# EAGLE design DiffController (EAGLE 9.6.2)
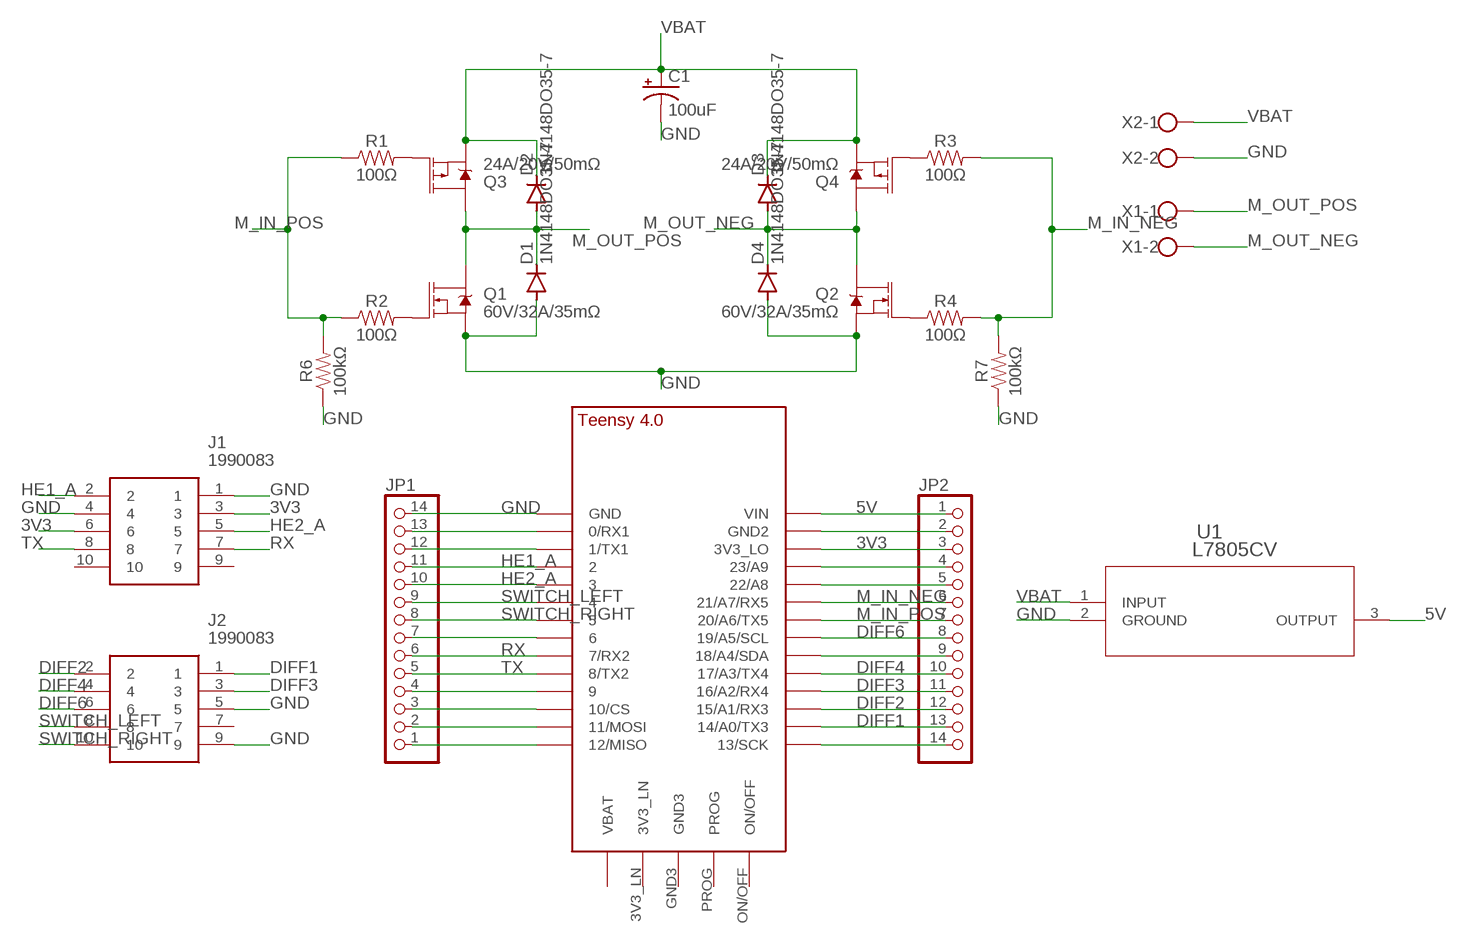
[diagram p0: schematic, sheet 1]

## Parts
C1  100uF  100UF-POLAR-RADIAL-2.5MM-25V-20%  [CPOL-RADIAL-2.5MM-6.5MM]
D1  1N4148DO35-7  [DO35-7]
D2  1N4148DO35-7  [DO35-7]
D3  1N4148DO35-7  [DO35-7]
D4  1N4148DO35-7  [DO35-7]
J1  1990083  [1990083]
J2  1990083  [1990083]
JP1  PINHD-1X14  [1X14]
JP2  PINHD-1X14  [1X14]
Q1  60V/32A/35mΩ  MOSFET-NCH-FQP30N06L  [TO220V]
Q2  60V/32A/35mΩ  MOSFET-NCH-FQP30N06L  [TO220V]
Q3  24A/20V/50mΩ  MOSFET_PCH-NDP6020P  [TO220V]
Q4  24A/20V/50mΩ  MOSFET_PCH-NDP6020P  [TO220V]
R1  100Ω  RESISTORAXIAL-0.3  [AXIAL-0.3]
R2  100Ω  RESISTORAXIAL-0.3  [AXIAL-0.3]
R3  100Ω  RESISTORAXIAL-0.3  [AXIAL-0.3]
R4  100Ω  RESISTORAXIAL-0.3  [AXIAL-0.3]
R6  100kΩ  RESISTORAXIAL-0.3  [AXIAL-0.3]
R7  100kΩ  RESISTORAXIAL-0.3  [AXIAL-0.3]
U1  L7805CV  [TO-220_STM]
U$2  TEENSY_4.0_EXPANDED_1  [TEENSY_4.0_EXPANDED_1]
X1  W237-102  [W237-102]
X2  W237-102  [W237-102]

## Nets
3V3: J1.3 J1.6 JP2.3 U$2.3V3_LO
5V: JP2.1 U1.3(OUTPUT) U$2.VIN
DIFF1: J2.1 JP2.13 U$2.14/A0(14/A0/TX3)
DIFF2: J2.2 JP2.12 U$2.15/A1(15/A1/RX3)
DIFF3: J2.3 JP2.11 U$2.16/A2(16/A2/RX4)
DIFF4: J2.4 JP2.10 U$2.17/A3(17/A3/TX4)
DIFF6: J2.6 JP2.8 U$2.19/A5/SCL
GND: C1.2(-) D1.A D4.A J1.1 J1.4 J2.5 J2.9 JP1.14 Q1.3(S) Q2.3(S) R6.P$1 R7.P$1 U1.2(GROUND) U$2.GND X2.2
HE1_A: J1.2 JP1.11 U$2.2
HE2_A: J1.5 JP1.10 U$2.3/CANTX
M_IN_NEG: JP2.6 R3.P$2 R4.P$2 R7.P$2 U$2.21/A7(21/A7/RX5)
M_IN_POS: JP2.7 R1.P$1 R2.P$1 R6.P$2 U$2.20/A6(20/A6/TX5)
M_OUT_NEG: D3.A D4.C Q2.2(D) Q4.2(D) X1.2
M_OUT_POS: D1.C D2.A Q1.2(D) Q3.2(D) X1.1
N$1: JP2.9 U$2.18/A4/SDA
N$2: JP2.4 U$2.23/A9
N$3: JP1.13 U$2.0/RX(0/RX1)
N$4: JP1.12 U$2.1/TX(1/TX1)
N$5: JP2.2 U$2.GND2
N$6: JP1.4 U$2.9/CS
N$7: JP1.3 U$2.10/CS
N$8: JP1.2 U$2.11/MOSI
N$9: JP1.1 U$2.12/MISO
N$10: JP2.14 U$2.13/SCK
N$11: JP1.7 U$2.6
N$12: JP2.5 U$2.22/A8
N$13: Q1.1(G) R2.P$2
N$14: Q2.1(G) R4.P$1
N$15: Q3.1(G) R1.P$2
N$16: Q4.1(G) R3.P$1
RX: J1.7 JP1.6 U$2.7(7/RX2)
SWITCH_LEFT: J2.8 JP1.9 U$2.4/CANRX
SWITCH_RIGHT: J2.10 JP1.8 U$2.5
TX: J1.8 JP1.5 U$2.8(8/TX2)
VBAT: C1.1(+) D2.C D3.C Q3.3(S) Q4.3(S) U1.1(INPUT) X2.1
Unconnected: J1.9 J1.10 J2.7 U$2.3V3_LN U$2.GND3 U$2.ON/OFF U$2.PROG U$2.VBAT\(VBAT)

## Library data of the parts
C1 = SparkFun-Capacitors:100UF-POLAR: 100µF polarized capacitors A capacitor is a passive two-terminal electrical component used to store electrical energy temporarily in an electric field.; PROD_ID: CAP-08439
D1-D4 = diode:1N4148: DIODE high speed (Philips)
J1 J2 = 1990083:1990083: Phoenix Contact PTSA 0.5/10-2.5-Z Non-Fused Terminal Block, 10 Way/Pole, Solder Terminals, 24 20 AWG Source: Datasheet <https://www.phoenixcontact.com/online/portal/in/?uri=pxc-oc-itemdetail:pid=1990083&library=inen&pcck=P-11-01-05&tab=1&selectedCategory=ALL>; ARROW_PART_NUMBER: 1990083; ARROW_PRICE-STOCK: https://www.arrow.com/en/products/1990083/phoenix-contact; DESCRIPTION: Phoenix Contact PTSA 0.5/10-2.5-Z Non-Fused Terminal Block, 10 Way/Pole, Solder Terminals, 24 20 AWG; HEIGHT: 13.1mm; MANUFACTURER_NAME: Phoenix Contact; MANUFACTURER_PART_NUMBER: 1990083; MOUSER_PART_NUMBER: 651-1990083; MOUSER_PRICE-STOCK: https://www.mouser.co.uk/ProductDetail/Phoenix-Contact/1990083?qs=eiqBpq341KUxP7V1ZFOCBQ%3D%3D
JP1 JP2 = Connectors:PINHD-1X14: PIN HEADER
Q1 Q2 = SparkFun-DiscreteSemi:MOSFET-NCH: N-channel MOSFETs Voltage controlled devices that allow control of high current outputs. SparkFun Products: SparkFun OpenScale <https://www.sparkfun.com/products/13261> SparkFun Digital Sandbox <https://www.sparkfun.com/products/12651> SparkFun Monster Moto Shield <https://www.sparkfun.com/products/10182> SparkFun MOSFET Power Controller <https://www.sparkfun.com/products/11214>; PROD_ID: TRANS-10060
Q3 Q4 = SparkFun-DiscreteSemi:MOSFET_PCH: P-channel MOSFETs Voltage controlled devices that allow control of high current outputs. SparkFun Products: SparkFun ESP32 Thing <https://www.sparkfun.com/products/13907> SparkFun ESP8266 Thing <https://www.sparkfun.com/products/13231>; PROD_ID: TRANS-13060
R1-R4 R6 R7 = SparkFun-Resistors:RESISTOR: Generic Resistor Package
U1 = L7805CV:L7805CV; BUILT_BY: EMA_UL_Team; MANUFACTURER_PART_NUMBER: L7805CV; SOURCELIBRARY: Updates_to_database_2020-11-10; VENDOR: STMicroelectronics
U$2 = Microcontroller:TEENSY_4.0_EXPANDED_1
X1 X2 = con-wago-500:W237-102: WAGO SCREW CLAMP; MPN: 237-102; OC_FARNELL: unknown; OC_NEWARK: 70K9898

## Board
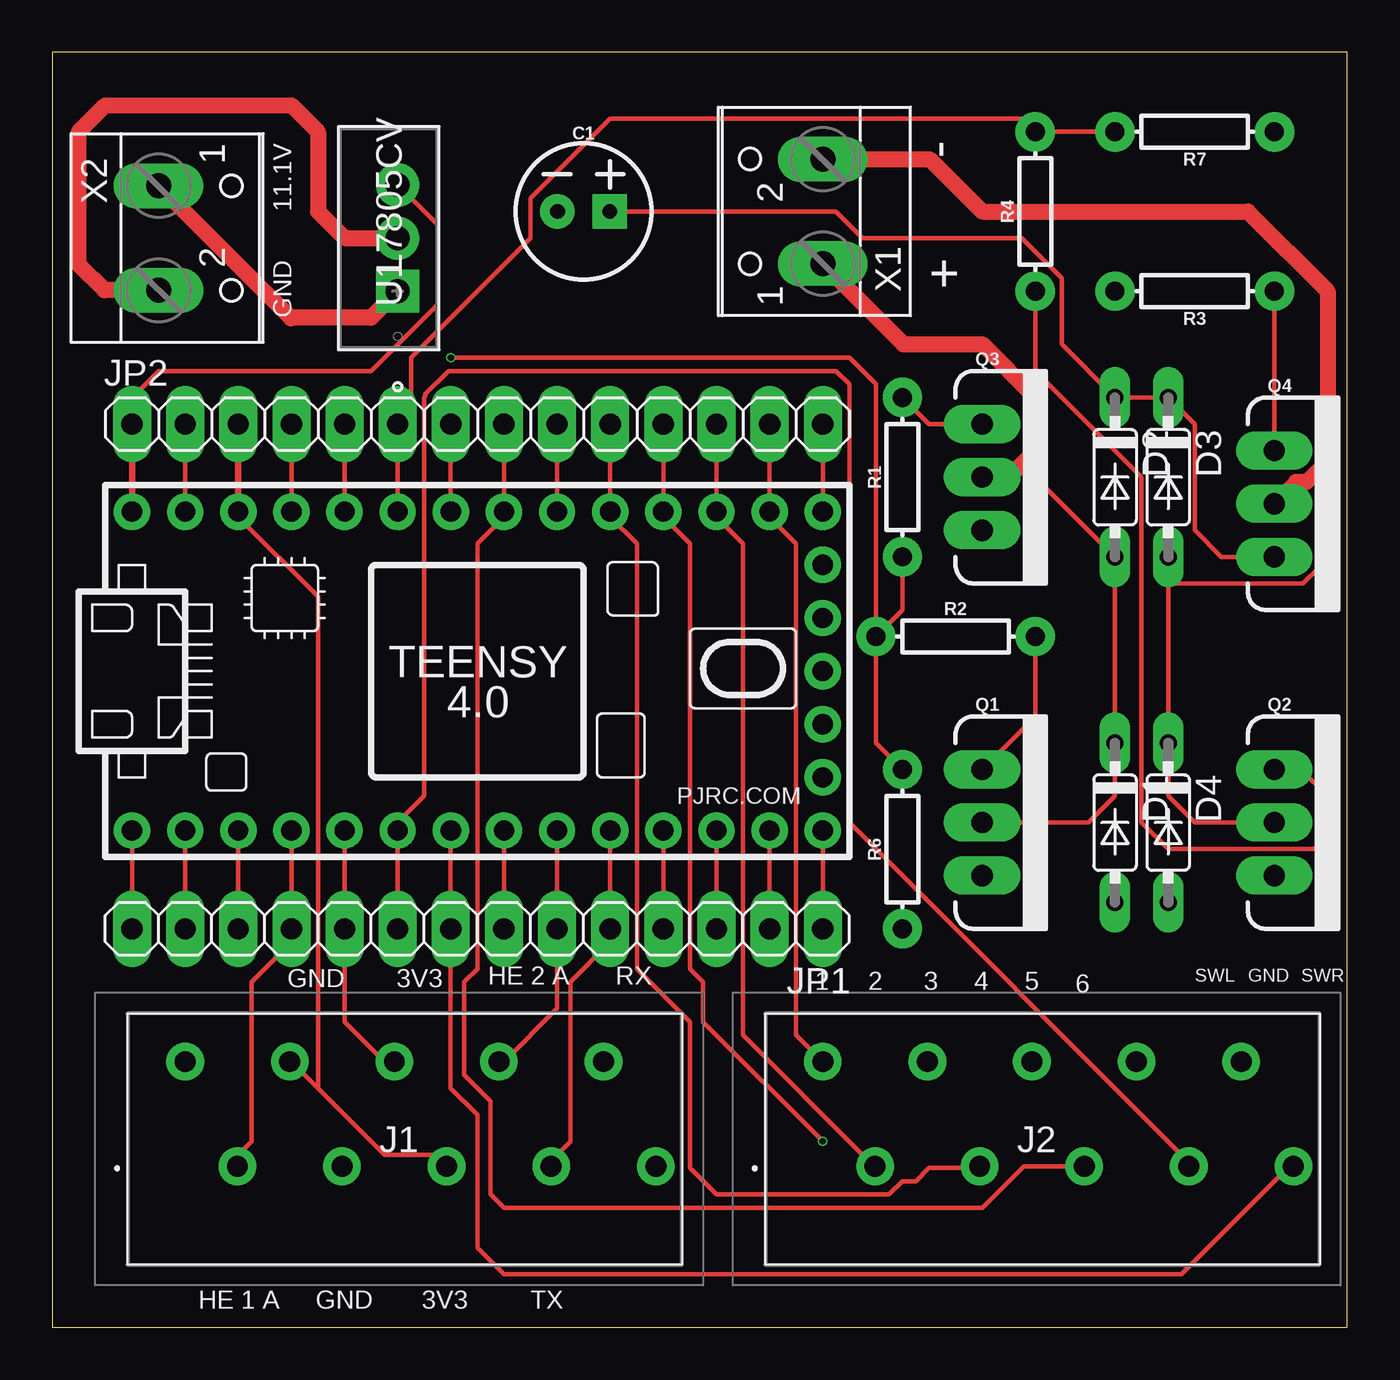
[diagram p1: board, top side]
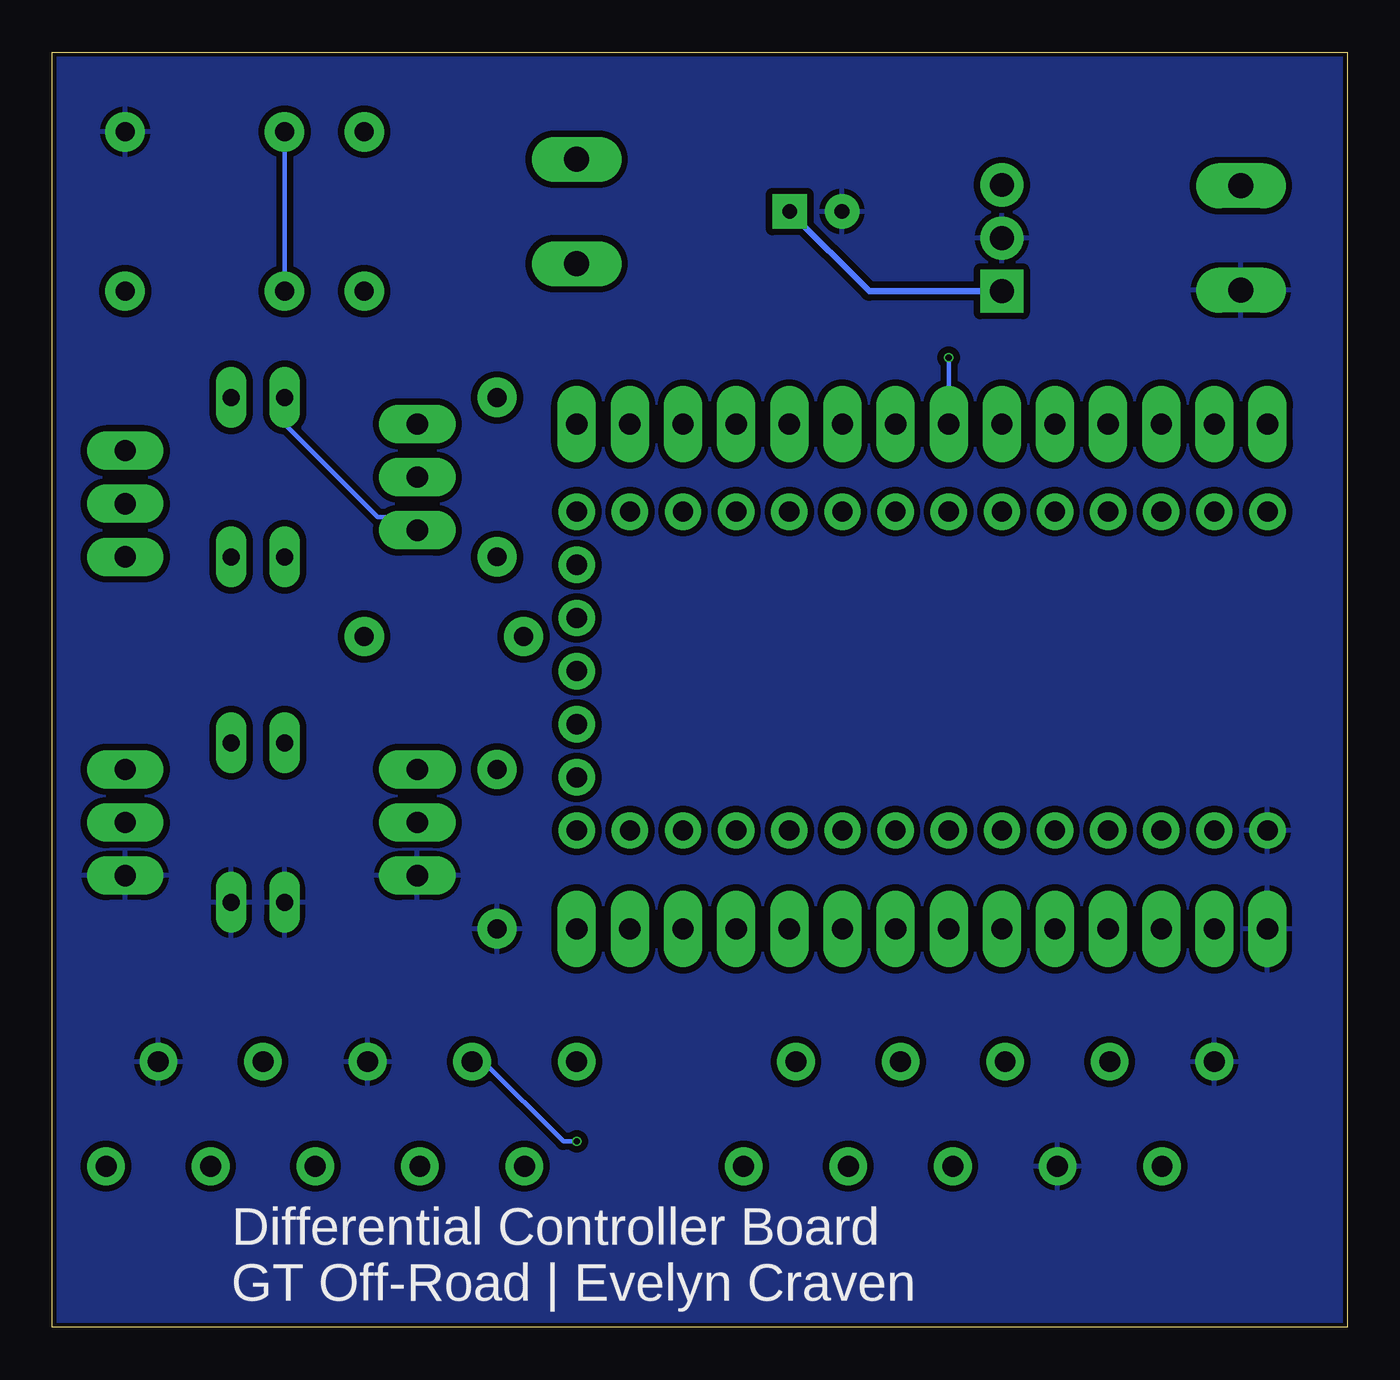
[diagram p2: board, bottom side, seen from below]

Size 61.9 x 60.95 mm. Coordinates in mm from the lower left corner, seen from the top.
Outline: 0,0 61.9,0 61.9,60.95 0,60.95 0,0
Copper layers (1*16): Top 0.035mm / dielectric 1.6mm / Bottom 0.035mm
Design rules "jlcpcb-2layers *": minimum track width 8mil, minimum drill 0.3mm, track to track 12mil, track to pad 8mil, pad to pad 8mil, via to via 8mil, smd to smd 5mil, copper to edge 0.2mm, drill to drill 6mil, minimum pad ring 10mil, minimum via ring 3mil, stop-mask expansion 4mil, vias tented up to drill 0mil, thermal gap 10mil

### Footprints (pad centres in the part's own frame; a part is rotated, then mirrored left to right if it is on the bottom)
CPOL-RADIAL-2.5MM-6.5MM = drill 0.7 pad 1.651 square: 1 1.25,0 | drill 0.7 pad 1.651: 2 -1.25,0
DO35-7 = drill 0.813 long: A 3.81,0; C -3.81,0
1990083 = drill 1 pad 1.5: 1 0,0; 2 2.5,-5; 3 5,0; 4 7.5,-5; 5 10,0; 6 12.5,-5; 7 15,0; 8 17.5,-5; 9 20,0; 10 22.5,-5
1X14 = drill 1.016 long: 1 -16.51,0; 2 -13.97,0; 3 -11.43,0; 4 -8.89,0; 5 -6.35,0; 6 -3.81,0; 7 -1.27,0; 8 1.27,0; 9 3.81,0; 10 6.35,0; 11 8.89,0; 12 11.43,0; 13 13.97,0; 14 16.51,0
TO220V = drill 1.016 long: 1 -2.54,0; 2 0,0; 3 2.54,0
AXIAL-0.3 = drill 0.9 pad 1.88: P$1 -3.81,0; P$2 3.81,0
TO-220_STM = drill 1.143 pad 1.651 square: 1 0,0 | drill 1.143 pad 1.651: 2 2.54,0; 3 5.08,0
TEENSY_4.0_EXPANDED_1 = drill 0.965: 0/RX -13.97,-7.62; 1/TX -11.43,-7.62; 2 -8.89,-7.62; 3/CANTX -6.35,-7.62; 3V3_LN 16.51,-2.54; 3V3_LO -11.43,7.62; 4/CANRX -3.81,-7.62; 5 -1.27,-7.62; 6 1.27,-7.62; 7 3.81,-7.62; 8 6.35,-7.62; 9/CS 8.89,-7.62; 10/CS 11.43,-7.62; 11/MOSI 13.97,-7.62; 12/MISO 16.51,-7.62; 13/SCK 16.51,7.62; 14/A0 13.97,7.62; 15/A1 11.43,7.62; 16/A2 8.89,7.62; 17/A3 6.35,7.62; 18/A4/SDA 3.81,7.62; 19/A5/SCL 1.27,7.62; 20/A6 -1.27,7.62; 21/A7 -3.81,7.62; 22/A8 -6.35,7.62; 23/A9 -8.89,7.62; GND -16.51,-7.62; GND2 -13.97,7.62; GND3 16.51,0; ON/OFF 16.51,5.08; PROG 16.51,2.54; VBAT\ 16.51,-5.08; VIN -16.51,7.62
W237-102 = drill 1.194 long: 1 -2.5,-1.27; 2 2.5,-1.27

### Placement (x,y rotation side)
C1  25.4,53.34 0 top
D1  50.8,24.13 270 top
D2  50.8,40.64 270 top
D3  53.34,40.64 270 top
D4  53.34,24.13 270 top
J1  6.35,12.7 0 top
J2  36.83,12.7 0 top
JP1  20.32,19.05 180 top
JP2  20.32,43.18 0 top
Q1  44.45,24.13 270 top
Q2  58.42,24.13 270 top
Q3  44.45,40.64 270 top
Q4  58.42,39.37 270 top
R1  40.64,40.64 90 top
R2  43.18,33.02 0 top
R3  54.61,49.53 180 top
R4  46.99,53.34 90 top
R6  40.64,22.86 90 top
R7  54.61,57.15 180 top
U1  16.51,49.53 90 top
U$2  20.32,31.37 0 top
X1  35.56,53.34 90 top
X2  6.35,52.07 270 top

### Tracks (layer width: path | path; a pad name or v marks a point on that pad's centre or on a via)
3V3
  Top 0.203: 12.7,11.43 15.88,8.26 18.41,8.26 J1.6 | 12.7,11.43 11.43,12.7 J1.3 | 12.7,11.43 12.7,34.92 8.89,38.73 U$2.3V3_LO
  Top 0.305: U$2.3V3_LO JP2.3
5V
  Top 0.203: U1.3 18.41,52.7 18.41,48.89 15.24,45.72 5.08,45.72 3.81,44.45 JP2.1
  Top 0.305: U$2.VIN JP2.1
DIFF1
  Top 0.203: JP2.13 U$2.14/A0 34.29,38.73 35.56,37.46 35.56,13.97 J2.1
DIFF2
  Top 0.203: JP2.12 U$2.15/A1 31.75,38.73 33.02,37.46 33.02,13.97 38.73,8.26 J2.2
DIFF3  (via drill 0.3)
  Top 0.203: JP2.11 U$2.16/A2 29.21,38.73 30.48,37.46 30.48,17.14 31.11,16.51 31.11,14.61 v36.83,8.89
  Bottom 0.203: v36.83,8.89 37.47,8.89 41.27,12.7 J2.3
DIFF4
  Top 0.203: JP2.10 U$2.17/A3 26.67,38.73 27.94,37.46 27.94,17.14 30.48,14.61 30.48,7.62 31.75,6.35 40.01,6.35 40.64,6.99 41.27,6.99 41.91,7.62 43.81,7.62 J2.4
DIFF6
  Top 0.203: JP2.8 U$2.19/A5/SCL 21.59,38.73 20.32,37.46 20.32,17.14 19.68,16.51 19.68,12.07 20.95,10.79 20.95,6.35 21.59,5.71 44.45,5.71 46.44,7.7 J2.6
GND
  Top 0.203: U$2.GND JP1.14
  Top 0.762: X2.2 2.5,49.57 1.27,50.8 1.27,57.15 2.54,58.42 11.43,58.42 12.7,57.15 12.7,53.34 13.97,52.07 U1.2
  pour Bottom: 0,60.96 62.23,60.96 62.23,0 0,0
HE1_A
  Top 0.203: U$2.2 JP1.11 11.43,18.41 9.53,16.51 9.53,8.89 8.89,8.26 J1.2
HE2_A
  Top 0.203: U$2.3/CANTX JP1.10 13.97,14.61 15.88,12.7 J1.5
M_IN_NEG
  Top 0.203: U$2.21/A7 JP2.6 17.14,43.81 17.14,46.35 22.86,52.07 22.86,53.97 26.67,57.78 46.99,57.78 R4.P$2 R7.P$2
  Bottom 0.203: R7.P$2 R3.P$2
M_IN_POS  (via drill 0.3)
  Top 0.203: JP2.7 U$2.20/A6 | R2.P$1 40.64,34.29 R1.P$1 | R6.P$2 39.37,27.94 R2.P$1 | v19.05,46.35 38.1,46.35 39.37,45.08 R2.P$1
  Bottom 0.203: v19.05,46.35 JP2.7
M_OUT_NEG
  Top 0.203: 53.34,35.56 D4.C 53.34,25.4 54.61,24.13 Q2.2 | 60.96,41.42 60.96,36.83 60.55,36.42 60.55,36.32 59.79,35.56 53.34,35.56 | 53.34,35.56 D3.A
  Top 0.762: X1.2 41.95,55.84 44.45,53.34 57.15,53.34 60.96,49.53 60.96,41.42 59.95,40.41 59.46,40.41 Q4.2
M_OUT_POS
  Top 0.203: Q1.2 49.53,24.13 50.8,25.4 D1.C D2.A 46.35,41.27
  Top 0.762: X1.1 40.68,46.99 44.45,46.99 46.99,44.45 46.99,41.91 46.35,41.27 45.72,40.64 Q3.2
N$1
  Top 0.203: JP2.9 U$2.18/A4/SDA
N$2
  Top 0.203: JP2.4 U$2.23/A9
N$3
  Top 0.203: JP1.13 U$2.0/RX
N$4
  Top 0.203: JP1.12 U$2.1/TX
N$5
  Top 0.203: JP2.2 U$2.GND2
N$6
  Top 0.203: JP1.4 U$2.9/CS
N$7
  Top 0.203: JP1.3 U$2.10/CS
N$8
  Top 0.203: JP1.2 U$2.11/MOSI
N$9
  Top 0.203: JP1.1 U$2.12/MISO
N$10
  Top 0.203: JP2.14 U$2.13/SCK
N$11
  Top 0.203: JP1.7 U$2.6
N$12
  Top 0.203: JP2.5 U$2.22/A8
N$13
  Top 0.203: Q1.1 46.99,29.21 R2.P$2
N$14
  Top 0.203: Q2.1 59.69,26.67 60.96,25.4 60.96,23.5 60.33,22.86 53.34,22.86 52.07,24.13 52.07,40.64 46.99,45.72 R4.P$1
N$15
  Top 0.203: Q3.1 41.91,43.18 R1.P$2
N$16
  Top 0.203: R3.P$1 Q4.1
RX
  Top 0.203: U$2.7 JP1.6 24.13,15.24 21.59,12.7 J1.7
SWITCH_LEFT
  Top 0.203: JP1.9 U$2.4/CANRX 16.51,24.13 17.78,25.4 17.78,44.45 17.83,44.5 17.83,44.6 18.95,45.72 37.47,45.72 38.1,45.08 38.1,24.13 53.98,8.26 J2.8
SWITCH_RIGHT
  Top 0.203: U$2.5 JP1.8 19.05,11.43 20.32,10.16 20.32,3.81 21.59,2.54 53.98,2.54 59.05,7.62 J2.10
TX
  Top 0.203: U$2.8 JP1.5 26.67,18.41 24.77,16.51 24.77,8.89 24.13,8.26 J1.8
VBAT
  Top 0.203: Q4.3 55.88,36.83 54.61,38.1 54.61,43.18 D3.C D2.C 48.26,46.99 48.26,50.16 46.35,52.07 38.73,52.07 37.47,53.34 C1.1
  Top 0.762: X2.1 11.42,48.23 11.47,48.26 15.24,48.26 U1.1
  Bottom 0.203: Q3.3 45.09,38.73 46.35,38.73 50.8,43.18 D2.C
  Bottom 0.305: U1.1 22.84,49.53 C1.1

### Text on the board
tPlace: - | 11.1V | + | GND | GND | 3V3 | HE 2 A | RX | SWL | GND | SWR | 1 | 2 | 3 | 4 | 5 | 6 | HE 1 A | GND | 3V3 | TX
bPlace: Differential Controller Board / GT Off-Road | Evelyn Craven